# EAGLE schematic display_schematic (EAGLE 6.4)
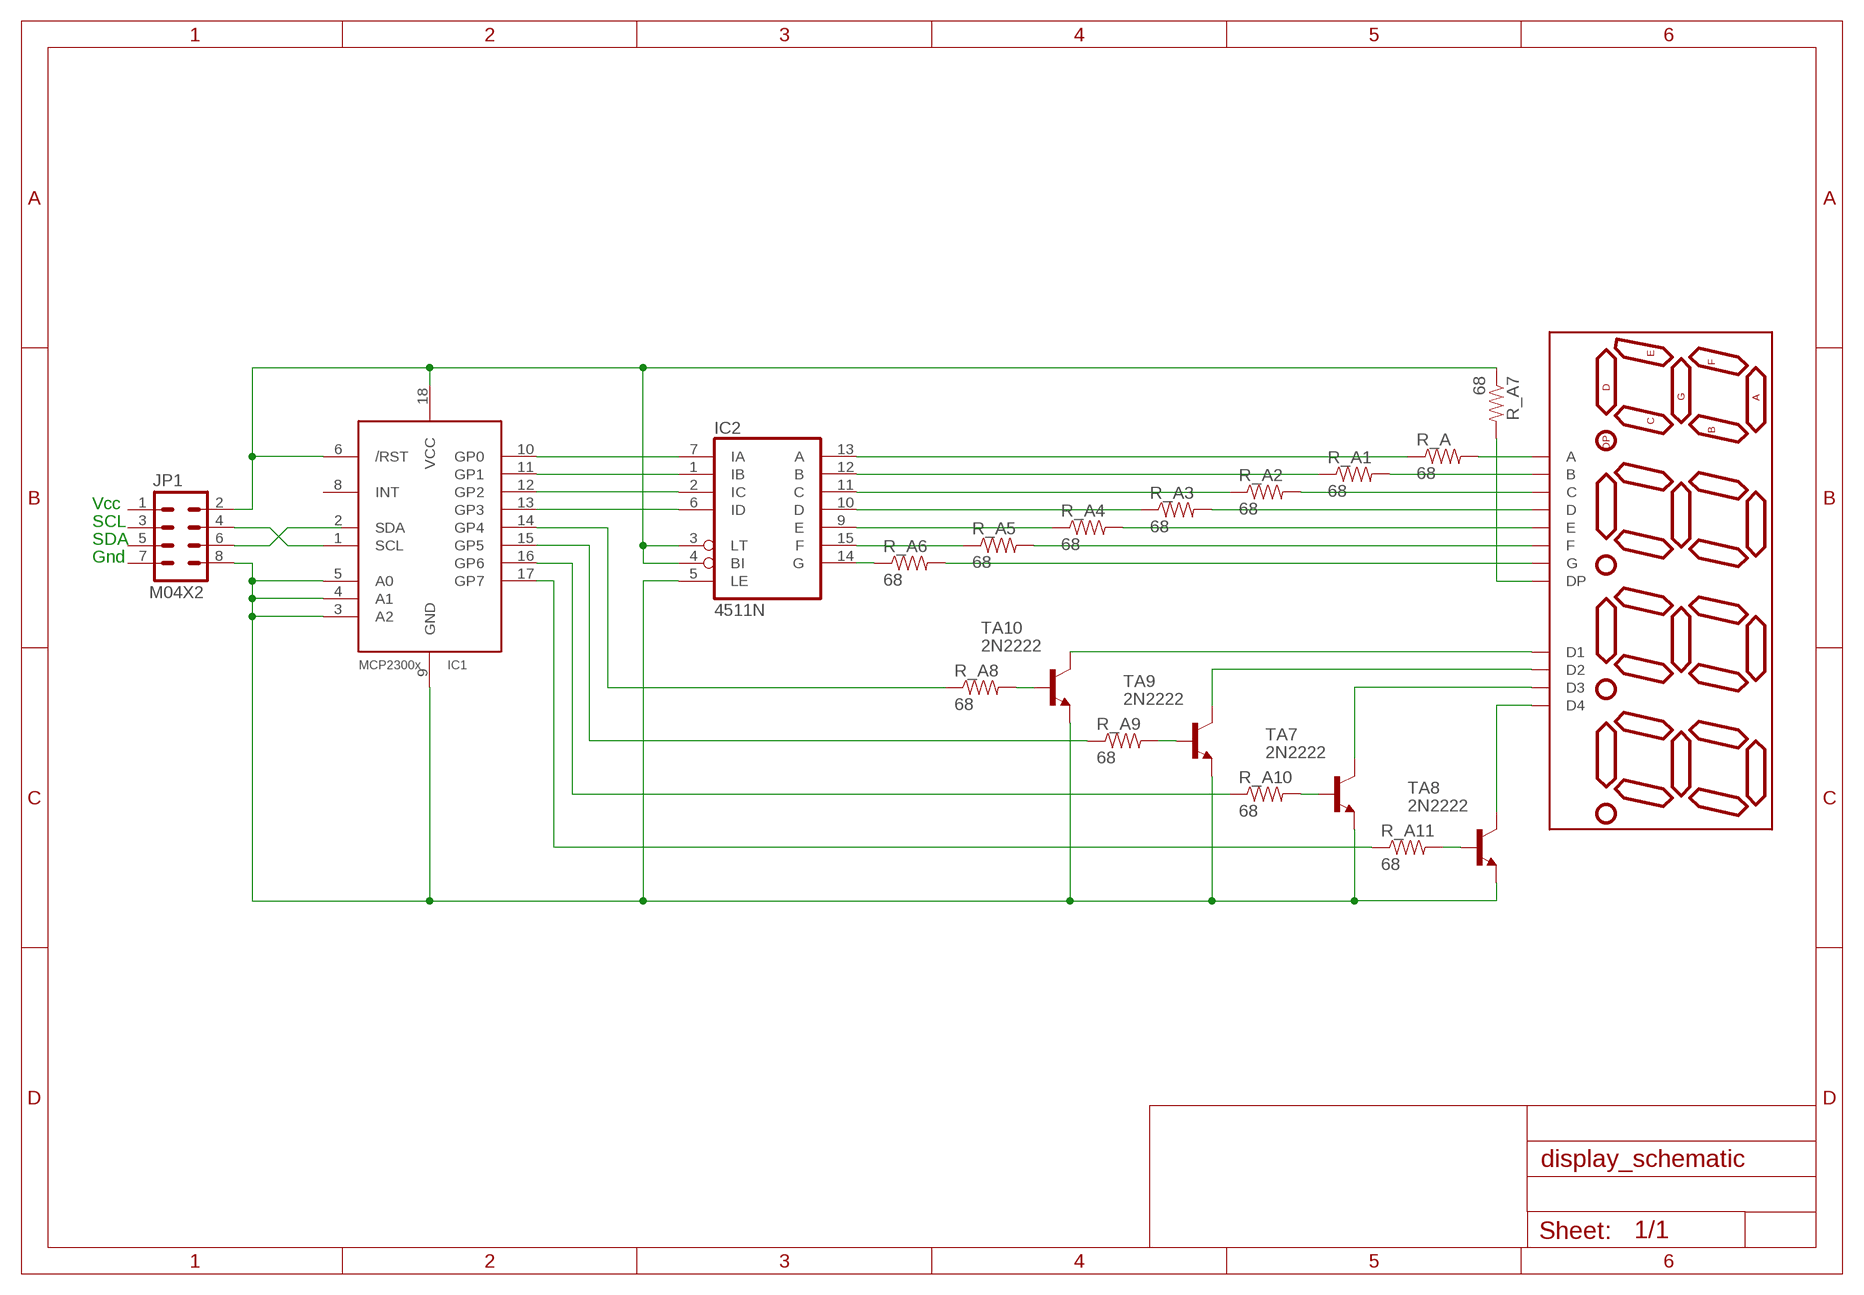
[diagram p0: schematic, sheet 1]

## Parts
DISPLAY7S4D1  7SEG-4DIG-NEW  [7SEG-4DIG-NEW]
IC1  MCP2300X/P  [DIL18]
IC2  4511N  [DIL16]
JP1  M04X2  [2X4]
R_A  68  RESISTORAXIAL-0.3  [AXIAL-0.3]
R_A1  68  RESISTORAXIAL-0.3  [AXIAL-0.3]
R_A2  68  RESISTORAXIAL-0.3  [AXIAL-0.3]
R_A3  68  RESISTORAXIAL-0.3  [AXIAL-0.3]
R_A4  68  RESISTORAXIAL-0.3  [AXIAL-0.3]
R_A5  68  RESISTORAXIAL-0.3  [AXIAL-0.3]
R_A6  68  RESISTORAXIAL-0.3  [AXIAL-0.3]
R_A7  68  RESISTORAXIAL-0.3  [AXIAL-0.3]
R_A8  68  RESISTORAXIAL-0.3  [AXIAL-0.3]
R_A9  68  RESISTORAXIAL-0.3  [AXIAL-0.3]
R_A10  68  RESISTORAXIAL-0.3  [AXIAL-0.3]
R_A11  68  RESISTORAXIAL-0.3  [AXIAL-0.3]
TA7  2N2222  [TO92-EBC-OVAL]
TA8  2N2222  [TO92-EBC-OVAL]
TA9  2N2222  [TO92-EBC-OVAL]
TA10  2N2222  [TO92-EBC-OVAL]

## Nets
N$1: IC1.6(/RST) IC1.18(VCC) IC2.3(LT) IC2.4(BI) JP1.2 R_A7.P$1
N$2: IC1.3(A2) IC1.4(A1) IC1.5(A0) IC1.9(GND) IC2.5(LE) JP1.8 TA7.E TA8.E TA9.E TA10.E
N$3: IC1.1(SCL) JP1.4
N$4: JP1.6
N$5: IC2.14(G) R_A6.P$1
N$6: DISPLAY7S4D1.11(A) R_A.P$2
N$7: IC1.13(GP3) IC2.6(ID)
N$8: IC1.11(GP1) IC2.1(IB)
N$9: IC1.12(GP2) IC2.2(IC)
N$10: IC1.10(GP0) IC2.7(IA)
N$11: DISPLAY7S4D1.3(DP) R_A7.P$2
N$12: DISPLAY7S4D1.12(D1) TA10.C
N$13: DISPLAY7S4D1.9(D2) TA9.C
N$14: IC2.15(F) R_A5.P$1
N$15: DISPLAY7S4D1.7(B) R_A1.P$2
N$16: IC2.9(E) R_A4.P$1
N$17: DISPLAY7S4D1.4(C) R_A2.P$2
N$18: DISPLAY7S4D1.2(D) R_A3.P$2
N$19: DISPLAY7S4D1.8(D3) TA7.C
N$20: DISPLAY7S4D1.6(D4) TA8.C
N$21: DISPLAY7S4D1.1(E) R_A4.P$2
N$22: IC1.14(GP4) R_A8.P$1
N$23: R_A11.P$2 TA8.B
N$24: R_A9.P$2 TA9.B
N$25: DISPLAY7S4D1.10(F) R_A5.P$2
N$26: DISPLAY7S4D1.5(G) R_A6.P$2
N$27: IC2.10(D) R_A3.P$1
N$28: IC2.11(C) R_A2.P$1
N$29: IC1.17(GP7) R_A11.P$1
N$30: IC1.16(GP6) R_A10.P$1
N$31: IC1.15(GP5) R_A9.P$1
N$32: R_A8.P$2 TA10.B
N$33: R_A10.P$2 TA7.B
N$39: IC2.12(B) R_A1.P$1
N$40: IC2.13(A) R_A.P$1
Unconnected: IC1.2(SDA) IC1.8(INT) JP1.1 JP1.3 JP1.5 JP1.7

## Notes on the sheet
- Vcc
- SCL
- SDA
- Gnd

## Power pins joined to a net without a drawn wire
VDD: IC2.16(VDD)
VSS: IC2.8(VSS)

## Library data of the parts
DISPLAY7S4D1 = SparkFun-Displays:7SEG-4DIG-NEW
IC1 = adafruit:MCP2300X: MCP23008 Inexpensive i2c i/o expander - 8 general purpose i/o pins with optional pullups
IC2 = 45xx:4511: BCD to 7-segment LATCH/DECODER/DRIVER
JP1 = SparkFun-Connectors:M04X2: .1" header, two rows of four.
R_A R_A1-R_A11 = SparkFun-Resistors:RESISTOR: Resistor Basic schematic elements and footprints for 0603, 1206, and PTH resistors.
TA7-TA10 = adafruit:2N2222: NPN TRANSISTOR Big oval pads